# Altium schematic sheet Connector_AnalogSig.SchDoc
size A4; SheetNumber: 7; SheetTotal: 9
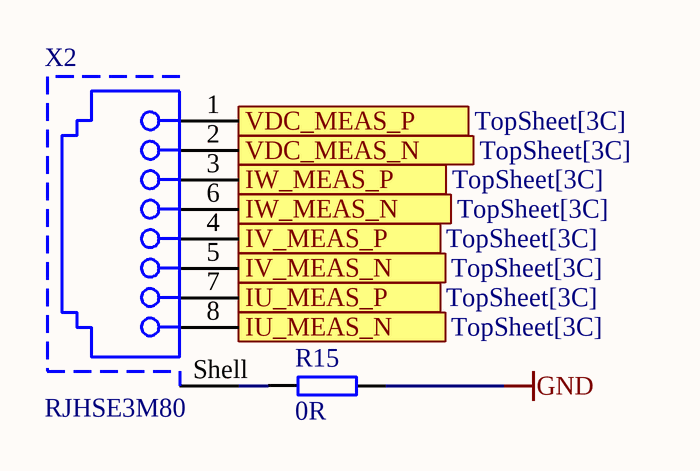
[diagram p0: Connector_AnalogSig.SchDoc]

## Parts
R15  0R  [RES 0603_1608]
X2  RJHSE3M80  [RJHSE3M80]

## Ports
IU_MEAS_N (in, see TopSheet[3C]), IU_MEAS_P (in, see TopSheet[3C]), IV_MEAS_N (in, see TopSheet[3C]), IV_MEAS_P (in, see TopSheet[3C]), IW_MEAS_N (in, see TopSheet[3C]), IW_MEAS_P (in, see TopSheet[3C]), VDC_MEAS_N (in, see TopSheet[3C]), VDC_MEAS_P (in, see TopSheet[3C])

## Nets
GND: R15.2
IU_MEAS_N: X2.8 ; port IU_MEAS_N
IU_MEAS_P: X2.7 ; port IU_MEAS_P
IV_MEAS_N: X2.5 ; port IV_MEAS_N
IV_MEAS_P: X2.4 ; port IV_MEAS_P
IW_MEAS_N: X2.6 ; port IW_MEAS_N
IW_MEAS_P: X2.3 ; port IW_MEAS_P
VDC_MEAS_N: X2.2 ; port VDC_MEAS_N
VDC_MEAS_P: X2.1 ; port VDC_MEAS_P
NetR15_1: R15.1 X2.Shell

## Library data of the parts
R15 = RC0603JR-070RL: SMD resistor E24 series; Manufacturer: YAGEO; Tolerance: 5%; Created from: MGremer; Manufacturer Part Number: RC0603JR-070RL; PartID: 1; Created On: 14/12/2020 16:17:14; ComponentLink1Description: Datasheet; ComponentLink1URL: https://www.mouser.de/datasheet/2/447/PYu-RC_Group_51_RoHS_L_10-1664068.pdf; Component Type: SMD resistor; Device Package: 0603; Last Updated: 04/03/2021 09:09:42; Mounting Type: SMD; Supplier 1: Mouser; Supplier Part Number 1: 603-RC0603JR-070RL; Supplier 2: LCSC; Supplier Part Number 2: C21189; Type: Resistor; Value: 0R; Live Cycle Status: 1; Stock number: Labor SMD Container; LCSC Part Number: C21189
X2 = RJHSE3M80: CAT5, RJ45 Connector, 1 port, vertical; Manufacturer: Amphenol; Created from: DHufnagel; Manufacturer Part Number: RJHSE3M80; PartID: 12; Created On: 06/06/2023 05:55:53; ComponentLink1Description: Datasheet; ComponentLink1URL: https://cdn.amphenol-cs.com/media/wysiwyg/files/documentation/datasheet/inputoutput/io-modjack-rjhse.pdf; Component Type: RJ45 Connector; Device Package: RJ45; Last Updated: 06/06/2023 05:55:53; Mounting Type: THT; Series: RJHSE; Supplier 1: Mouser; Supplier Part Number 1: 523-RJHSE3M80; Supplier 2: LCSC; Supplier Part Number 2: C3179193; Type: RJ45 Connector; Live Cycle Status: 1; LCSC Part Number: C3179193; Stock number: not stored